# Altium project dvrk-s-pwm.PrjPCB (part 1 of 2)
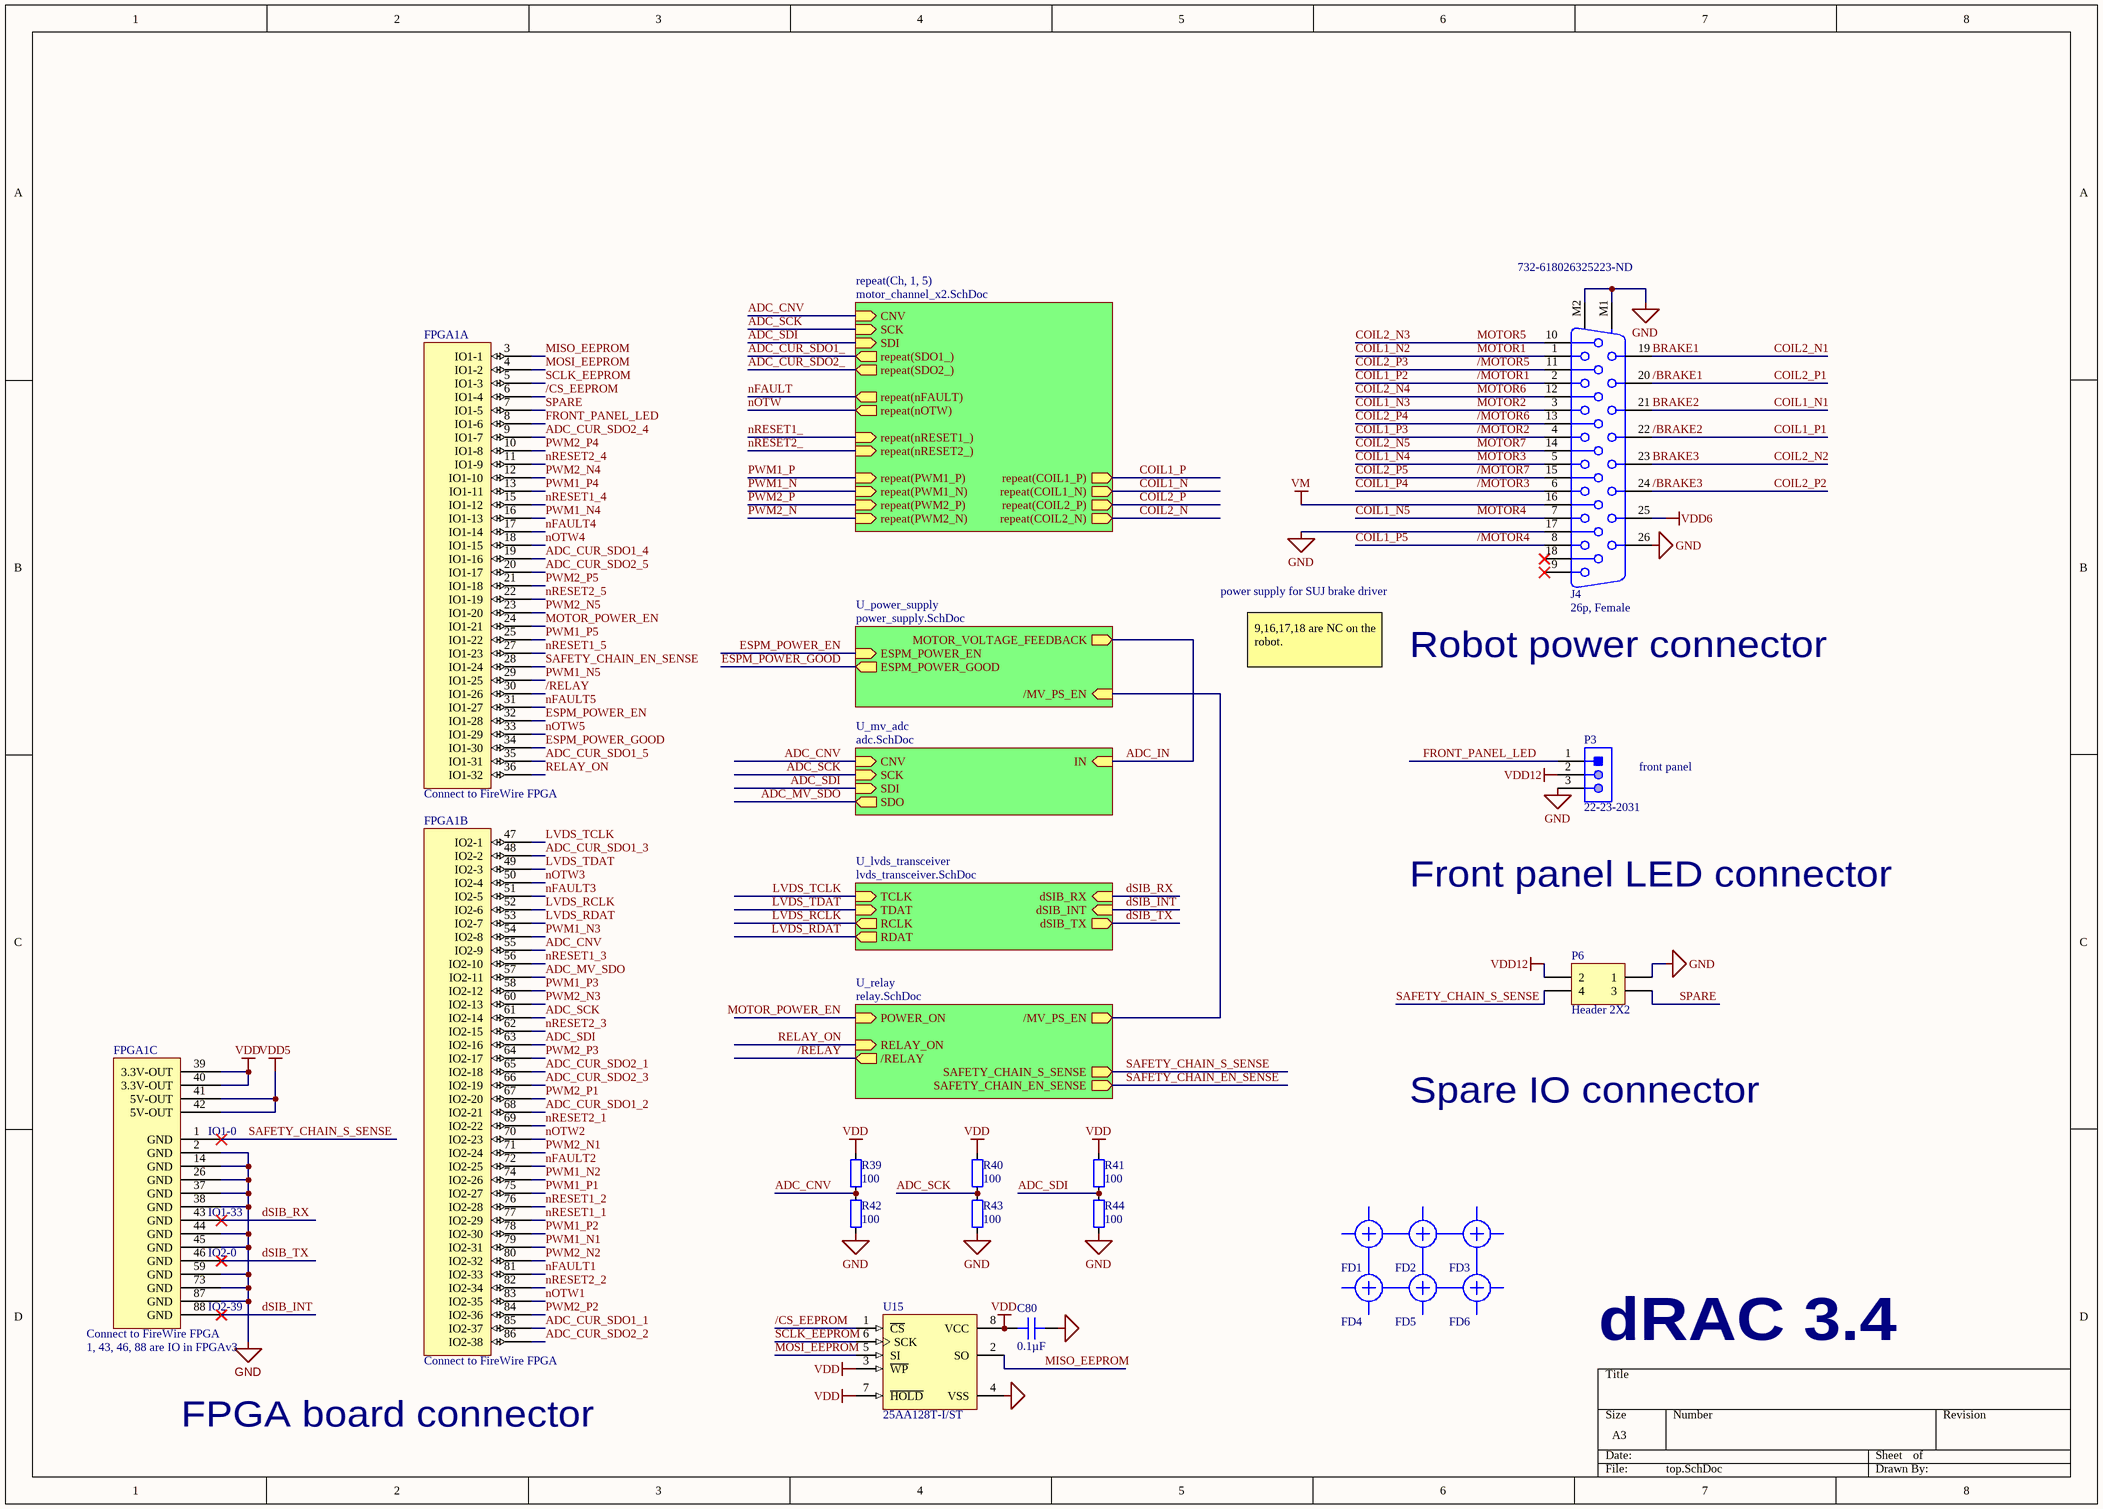
[diagram p0: top.SchDoc]
6 sheets, 492 parts. Net scope: hierarchical (ports join the sheet entries above them; power ports are global).
Board files: drac_v3.PcbDoc, drac_v3_panel.PcbDoc
Sheets:
  top.SchDoc
    U_mv_adc = adc.SchDoc
    U_power_supply = power_supply.SchDoc
    U_lvds_transceiver = lvds_transceiver.SchDoc
    U_relay = relay.SchDoc
    Ch1 = motor_channel_x2.SchDoc
    Ch2 = motor_channel_x2.SchDoc
    Ch3 = motor_channel_x2.SchDoc
    Ch4 = motor_channel_x2.SchDoc
    Ch5 = motor_channel_x2.SchDoc

## Sheet top.SchDoc
size A3; DocumentNumber: 1; SheetNumber: 1; SheetTotal: 6

### Parts
C80  0.1µF  [FP-GRM155-0_05-IPC_B]
FD1  FD  [FD]  (value not drawn)  (no BOM)
FD2  FD  [FD]  (value not drawn)  (no BOM)
FD3  FD  [FD]  (value not drawn)  (no BOM)
FD4  FD  [FD]  (value not drawn)  (no BOM)
FD5  FD  [FD]  (value not drawn)  (no BOM)
FD6  FD  [FD]  (value not drawn)  (no BOM)
FPGA1  Connect to FireWire FPGA  [FPGA-dummy]  (parts A,B,C of 3)
J4  26p, Female  Supplier Part Number 1: 732-618026325223-ND  [618026325223]
P3  22-23-2031  [MOLX-22-23-2031_V]
P6  Header 2X2  [DF11-4DP-2DSA]
R39  value 100  [FP-CRCW0805-HPe3-IPC_B]  (hidden comment: Res_0805)
R40  value 100  [FP-CRCW0805-HPe3-IPC_B]  (hidden comment: Res_0805)
R41  value 100  [FP-CRCW0805-HPe3-IPC_B]  (hidden comment: Res_0805)
R42  value 100  [FP-CRCW0805-HPe3-IPC_B]  (hidden comment: Res_0805)
R43  value 100  [FP-CRCW0805-HPe3-IPC_B]  (hidden comment: Res_0805)
R44  value 100  [FP-CRCW0805-HPe3-IPC_B]  (hidden comment: Res_0805)
U15  25AA128T-I/ST  [TSSOP-ST8_N]

### Sub-sheets
repeat(Ch, 1, 5) = motor_channel_x2.SchDoc: repeat(COIL1_P) (out), repeat(COIL1_N) (out), repeat(COIL2_P) (out), repeat(COIL2_N) (out), repeat(SDO1_) (out), repeat(SDO2_) (out), CNV (in), SCK (in), SDI (in), repeat(nRESET1_) (in), repeat(nRESET2_) (in), repeat(PWM1_P) (in), repeat(PWM1_N) (in), repeat(PWM2_P) (in), repeat(PWM2_N) (in), repeat(nFAULT) (out), repeat(nOTW) (out)
U_lvds_transceiver = lvds_transceiver.SchDoc: RCLK (out), RDAT (out), TCLK (in), TDAT (in), dSIB_RX (in), dSIB_INT (in), dSIB_TX (out)
U_mv_adc = adc.SchDoc: CNV (in), SCK (in), SDI (in), SDO (out), IN (in)
U_power_supply = power_supply.SchDoc: MOTOR_VOLTAGE_FEEDBACK (out), ESPM_POWER_GOOD (out), ESPM_POWER_EN (in), /MV_PS_EN (in)
U_relay = relay.SchDoc: POWER_ON (in), RELAY_ON (in), /RELAY (out), /MV_PS_EN (out), SAFETY_CHAIN_S_SENSE (out), SAFETY_CHAIN_EN_SENSE (out)

### Nets
GND: C80.2 FPGA1.2(GND) FPGA1.14(GND) FPGA1.26(GND) FPGA1.37(GND) FPGA1.38(GND) FPGA1.44(GND) FPGA1.45(GND) FPGA1.59(GND) FPGA1.73(GND) FPGA1.87(GND) J4.17 J4.26 J4.M1 J4.M2 P3.3 P6.1 R42.1 R43.1 R44.1 U15.4(VSS)
VDD: C80.1 FPGA1.39(3.3V-OUT) FPGA1.40(3.3V-OUT) R39.2 R40.2 R41.2 U15.3(~{WP}) U15.7(~{HOLD}) U15.8(VCC)
VDD5: FPGA1.41(5V-OUT) FPGA1.42(5V-OUT)
VDD6: J4.25
VDD12: P3.2 P6.2
VM: J4.16
/BRAKE1: J4.20  [also labelled COIL2_P1]
/BRAKE2: J4.22  [also labelled COIL1_P1]
/BRAKE3: J4.24  [also labelled COIL2_P2]
/CS_EEPROM: FPGA1.6(IO1-4) U15.1(~{CS})
/MOTOR1: J4.2  [also labelled COIL1_P2]
/MOTOR2: J4.4  [also labelled COIL1_P3]
/MOTOR3: J4.6  [also labelled COIL1_P4]
/MOTOR4: J4.8  [also labelled COIL1_P5]
/MOTOR5: J4.11  [also labelled COIL2_P3]
/MOTOR6: J4.13  [also labelled COIL2_P4]
/MOTOR7: J4.15  [also labelled COIL2_P5]
/RELAY: FPGA1.30(IO1-26) ; sheet U_relay//RELAY
ADC_CNV: FPGA1.55(IO2-9) R39.1 R42.2 ; sheet U_mv_adc/CNV, sheet repeat(Ch, 1, 5)/CNV
ADC_CUR_SDO1_: sheet repeat(Ch, 1, 5)/repeat(SDO1_)
ADC_CUR_SDO1_1: FPGA1.85(IO2-37)
ADC_CUR_SDO1_2: FPGA1.68(IO2-21)
ADC_CUR_SDO1_3: FPGA1.48(IO2-2)
ADC_CUR_SDO1_4: FPGA1.19(IO1-16)
ADC_CUR_SDO1_5: FPGA1.35(IO1-31)
ADC_CUR_SDO2_: sheet repeat(Ch, 1, 5)/repeat(SDO2_)
ADC_CUR_SDO2_1: FPGA1.65(IO2-18)
ADC_CUR_SDO2_2: FPGA1.86(IO2-38)
ADC_CUR_SDO2_3: FPGA1.66(IO2-19)
ADC_CUR_SDO2_4: FPGA1.9(IO1-7)
ADC_CUR_SDO2_5: FPGA1.20(IO1-17)
ADC_IN: sheet U_mv_adc/IN, sheet U_power_supply/MOTOR_VOLTAGE_FEEDBACK
ADC_MV_SDO: FPGA1.57(IO2-11) ; sheet U_mv_adc/SDO
ADC_SCK: FPGA1.61(IO2-14) R40.1 R43.2 ; sheet U_mv_adc/SCK, sheet repeat(Ch, 1, 5)/SCK
ADC_SDI: FPGA1.63(IO2-16) R41.1 R44.2 ; sheet U_mv_adc/SDI, sheet repeat(Ch, 1, 5)/SDI
BRAKE1: J4.19  [also labelled COIL2_N1]
BRAKE2: J4.21  [also labelled COIL1_N1]
BRAKE3: J4.23  [also labelled COIL2_N2]
COIL1_N: sheet repeat(Ch, 1, 5)/repeat(COIL1_N)
COIL1_N2: J4.1  [also labelled MOTOR1]
COIL1_N3: J4.3  [also labelled MOTOR2]
COIL1_N4: J4.5  [also labelled MOTOR3]
COIL1_N5: J4.7  [also labelled MOTOR4]
COIL1_P: sheet repeat(Ch, 1, 5)/repeat(COIL1_P)
COIL2_N: sheet repeat(Ch, 1, 5)/repeat(COIL2_N)
COIL2_N3: J4.10  [also labelled MOTOR5]
COIL2_N4: J4.12  [also labelled MOTOR6]
COIL2_N5: J4.14  [also labelled MOTOR7]
COIL2_P: sheet repeat(Ch, 1, 5)/repeat(COIL2_P)
dSIB_INT: FPGA1.88(GND) ; sheet U_lvds_transceiver/dSIB_INT
dSIB_RX: FPGA1.43(GND) ; sheet U_lvds_transceiver/dSIB_RX
dSIB_TX: FPGA1.46(GND) ; sheet U_lvds_transceiver/dSIB_TX
ESPM_POWER_EN: FPGA1.32(IO1-28) ; sheet U_power_supply/ESPM_POWER_EN
ESPM_POWER_GOOD: FPGA1.34(IO1-30) ; sheet U_power_supply/ESPM_POWER_GOOD
FRONT_PANEL_LED: FPGA1.8(IO1-6) P3.1
LVDS_RCLK: FPGA1.52(IO2-6) ; sheet U_lvds_transceiver/RCLK
LVDS_RDAT: FPGA1.53(IO2-7) ; sheet U_lvds_transceiver/RDAT
LVDS_TCLK: FPGA1.47(IO2-1) ; sheet U_lvds_transceiver/TCLK
LVDS_TDAT: FPGA1.49(IO2-3) ; sheet U_lvds_transceiver/TDAT
MISO_EEPROM: FPGA1.3(IO1-1) U15.2(SO)
MOSI_EEPROM: FPGA1.4(IO1-2) U15.5(SI)
MOTOR_POWER_EN: FPGA1.24(IO1-21) ; sheet U_relay/POWER_ON
nFAULT: sheet repeat(Ch, 1, 5)/repeat(nFAULT)
nFAULT1: FPGA1.81(IO2-33)
nFAULT2: FPGA1.72(IO2-25)
nFAULT3: FPGA1.51(IO2-5)
nFAULT4: FPGA1.17(IO1-14)
nFAULT5: FPGA1.31(IO1-27)
nOTW: sheet repeat(Ch, 1, 5)/repeat(nOTW)
nOTW1: FPGA1.83(IO2-35)
nOTW2: FPGA1.70(IO2-23)
nOTW3: FPGA1.50(IO2-4)
nOTW4: FPGA1.18(IO1-15)
nOTW5: FPGA1.33(IO1-29)
nRESET1_: sheet repeat(Ch, 1, 5)/repeat(nRESET1_)
nRESET1_1: FPGA1.77(IO2-29)
nRESET1_2: FPGA1.76(IO2-28)
nRESET1_3: FPGA1.56(IO2-10)
nRESET1_4: FPGA1.15(IO1-12)
nRESET1_5: FPGA1.27(IO1-23)
nRESET2_: sheet repeat(Ch, 1, 5)/repeat(nRESET2_)
nRESET2_1: FPGA1.69(IO2-22)
nRESET2_2: FPGA1.82(IO2-34)
nRESET2_3: FPGA1.62(IO2-15)
nRESET2_4: FPGA1.11(IO1-9)
nRESET2_5: FPGA1.22(IO1-19)
PWM1_N: sheet repeat(Ch, 1, 5)/repeat(PWM1_N)
PWM1_N1: FPGA1.79(IO2-31)
PWM1_N2: FPGA1.74(IO2-26)
PWM1_N3: FPGA1.54(IO2-8)
PWM1_N4: FPGA1.16(IO1-13)
PWM1_N5: FPGA1.29(IO1-25)
PWM1_P: sheet repeat(Ch, 1, 5)/repeat(PWM1_P)
PWM1_P1: FPGA1.75(IO2-27)
PWM1_P2: FPGA1.78(IO2-30)
PWM1_P3: FPGA1.58(IO2-12)
PWM1_P4: FPGA1.13(IO1-11)
PWM1_P5: FPGA1.25(IO1-22)
PWM2_N: sheet repeat(Ch, 1, 5)/repeat(PWM2_N)
PWM2_N1: FPGA1.71(IO2-24)
PWM2_N2: FPGA1.80(IO2-32)
PWM2_N3: FPGA1.60(IO2-13)
PWM2_N4: FPGA1.12(IO1-10)
PWM2_N5: FPGA1.23(IO1-20)
PWM2_P: sheet repeat(Ch, 1, 5)/repeat(PWM2_P)
PWM2_P1: FPGA1.67(IO2-20)
PWM2_P2: FPGA1.84(IO2-36)
PWM2_P3: FPGA1.64(IO2-17)
PWM2_P4: FPGA1.10(IO1-8)
PWM2_P5: FPGA1.21(IO1-18)
RELAY_ON: FPGA1.36(IO1-32) ; sheet U_relay/RELAY_ON  [project net RELAY-ON]
SAFETY_CHAIN_EN_SENSE: FPGA1.28(IO1-24) ; sheet U_relay/SAFETY_CHAIN_EN_SENSE
SAFETY_CHAIN_S_SENSE: FPGA1.1(GND) P6.4 ; sheet U_relay/SAFETY_CHAIN_S_SENSE
SCLK_EEPROM: FPGA1.5(IO1-3) U15.6(SCK)
SPARE: FPGA1.7(IO1-5) P6.3
NetJ2_1: sheet U_power_supply//MV_PS_EN, sheet U_relay//MV_PS_EN

Not connected (* = marked no-connect by the designer): J4 9* 18*

### Notes on the sheet
- power supply for SUJ brake driver
- 9,16,17,18 are NC on the robot.
- Robot power connector
- front panel
- Front panel LED connector
- Spare IO connector
- (near FPGA1) IO1-0
- (near FPGA1) IO1-33
- (near FPGA1) IO2-0
- (near FPGA1) IO2-39
- (near FPGA1) 1, 43, 46, 88 are IO in FPGAv3
- dRAC 3.4
- FPGA board connector

### Library data of the parts
C80 = 04023C104KAT2A: CAP CER 0.1UF 25V X7R 0402; Manufacturer: AVX Corporation; Tolerance: ±10%; Value: 0.1µF; Part Number: 04023C104KAT2A; Applications: General Purpose; Capacitance: 0.1µF; ComponentLink1Description: Datasheet; ComponentLink1URL: http://datasheets.avx.com/X7RDielectric.pdf; ComponentLink2Description: DigiKey Link; ComponentLink2URL: http://digikey.com/product-detail/en/avx-corporation/04023C104KAT2A/478-7868-1-ND/3881491; Device Package: 0402 (1005 Metric); LastUpdated: 9/2/2020 1:02:21 AM; Lifecycle Status: Active; Minimum Order: 1; Mounting Type: Surface Mount, MLCC; Operating Temperature: -55°C ~ 125°C; Package / Case: 0402 (1005 Metric); Packaging: CutTape; PartId: 3190; Part Status: Active; Price: 0.13; Series: -; Size / Dimension: 0.039" L x 0.020" W (1.00mm x 0.50mm); Supplier 1: DigiKey; Supplier Part Number 1: 478-7868-1-ND; Temperature Coefficient: X7R; Thickness (Max): 0.022" (0.55mm); Voltage - Rated: 25V
FPGA1 = fpga_dummy: ClassName: noclearancecheck
J4 = 618026325223: WR-DSUB Female High Density Angled PCB Connector without Hex Screw, 26p; Manufacturer: Wurth Electronics; PinNumber: 26; Published: June 2016; Publisher: Wurth Elektronik; ComponentLink1Description: Manufacturer; ComponentLink1URL: http://www.we-online.de; ComponentLink2Description: Datasheet; ComponentLink2URL: http://katalog.we-online.de/em/datasheet/6180xx325223.pdf; PartNumber: 618026325223; system: connector; Supplier 1: Digi-Key; Manufacturer Part Number: 618026325223; RoHS: Yes; Stock 1: 325; Pricing 1: 1=8.10000, 10=7.69500, 50=7.15500, 100=6.75000, 250=6.21000, 500=5.40002 (USD); RoHS Compliant: Yes
P3 = CMP-2000-05242-1: Male Header, Pitch 2.54 mm, 1 x 3 Position, Height 8.18 mm, Tail Length 3.56 mm, RoHS, Bulk; Current Rating: 4A; Brand: Molex; Pitch: 2.54mm; Voltage Rating: 250V; Mounting Angle: Vertical; Type: Locking; Factory Pack Quantity: 16000; Tradename: KK; Housing Material: Nylon; Contact Material: Brass; Manufacturer URL: http://www.molex.com/; Termination Style: ThroughHole; Mounting Style: ThroughHole; Number of Positions: 3Position; Contact Gender: Pin(Male); Packaging: Bulk; Series: 6373; Datasheet Version: Sep-01; Contact Plating: Tin; Product: Headers; Datasheet URL: https://datasheet.ciiva.com/19472/232274-19472863.pdf; RoHS: Details; Product Category: Headers&WireHousings; Manufacturer: Molex; Number of Rows: 1Row
P6 = Header 2X2: Header, 2-Pin, Dual row; LatestRevisionDate: 17-Jul-2002; LatestRevisionNote: Re-released for DXP Platform.; Publisher: Altium Limited
R39-R44 = Res_0805: Resistor
U15 = CMP-0165-00422-1: 128K SPI Bus Serial EEPROM, 8-Pin TSSOP, Industrial Temperature, Tape and Reel; PackageVersion: revBB, Aug-2009; PackageDescription: 8-Lead Plastic Thin Shrink Small Outline (ST) - 4.4mm Body [TSSOP]; Code_JEDEC: MO-153; DatasheetVersion: revD, Jun-2009; PackageReference: TSSOP-ST8

## Sheet adc.SchDoc
size Letter; DocumentNumber: 6; SheetNumber: 6; SheetTotal: 6
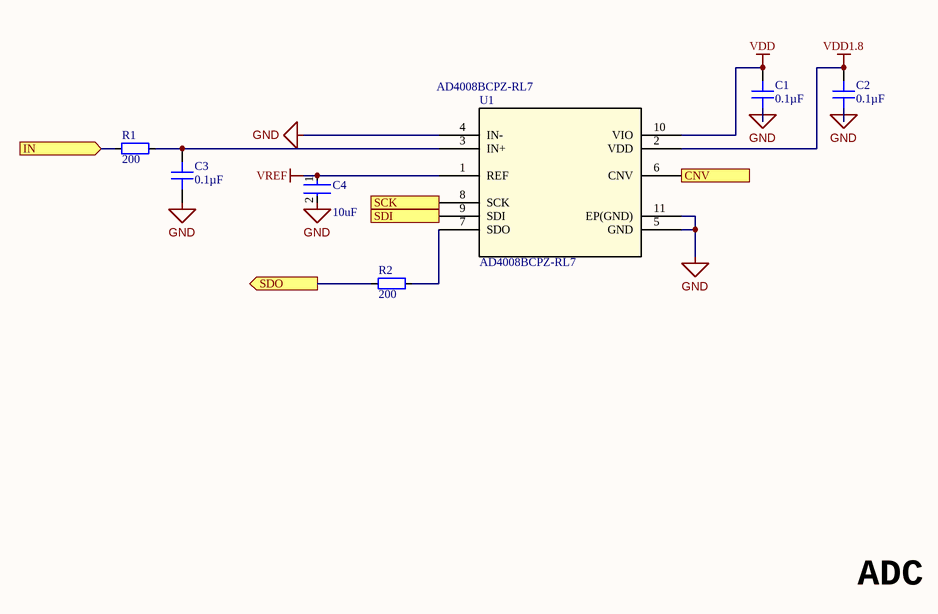
[diagram p1: adc.SchDoc]

### Parts
C1  0.1µF  [FP-GRM155-0_05-IPC_B]
C2  0.1µF  [FP-GRM155-0_05-IPC_B]
C3  0.1µF  [FP-GRM155-0_05-IPC_B]
C4  Capacitance: 10uF  [FP-CL21-IPC_C]  (hidden comment: CL21B106KQQNNNG)
R1  value 200  [FP-CRCW0402-e3-IPC_B]  (hidden comment: Res_0402)
R2  value 200  [FP-CRCW0402-e3-IPC_B]  (hidden comment: Res_0402)
U1  AD4008BCPZ-RL7  [CP_10_9]

### Ports
CNV (in), IN (in), SCK (in), SDI (in), SDO (out)

### Nets
GND: C1.2 C2.2 C3.2 C4.2 U1.4(IN-) U1.5(GND) U1.11(EP(GND))
VDD: C1.1 U1.10(VIO)
VDD1.8: C2.1 U1.2(VDD)
VREF: C4.1 U1.1(REF)
ADC_CNV: U1.6(CNV) ; port CNV
ADC_IN: R1.1 ; port IN
ADC_MV_SDO: R2.1 ; port SDO
ADC_SCK: U1.8(SCK) ; port SCK
ADC_SDI: U1.9(SDI) ; port SDI
NetC3_1: C3.1 R1.2 U1.3(IN+)
NetR2_2: R2.2 U1.7(SDO)

### Notes on the sheet
- ADC

### Library data of the parts
C1-C3 = 04023C104KAT2A: as C80 on sheet top; Value: 0.1µF; ComponentLink1Description: Datasheet; ComponentLink1URL: http://datasheets.avx.com/X7RDielectric.pdf; Supplier 1: DigiKey; Supplier Part Number 1: 478-7868-1-ND; Part Number: 04023C104KAT2A; Applications: General Purpose; Capacitance: 0.1µF; ComponentLink2Description: DigiKey Link; ComponentLink2URL: http://digikey.com/product-detail/en/avx-corporation/04023C104KAT2A/478-7868-1-ND/3881491; Device Package: 0402 (1005 Metric); LastUpdated: 9/2/2020 1:02:21 AM; Lifecycle Status: Active; Minimum Order: 1; Mounting Type: Surface Mount, MLCC; Operating Temperature: -55°C ~ 125°C; Package / Case: 0402 (1005 Metric); Packaging: CutTape; PartId: 3190; Part Status: Active; Price: 0.13; Series: -; Size / Dimension: 0.039" L x 0.020" W (1.00mm x 0.50mm); Temperature Coefficient: X7R; Thickness (Max): 0.022" (0.55mm); Voltage - Rated: 25V
C4 = CMP-13271-001427-1: CL21 Series 0805 10uF 6.3V ±10% Tolerance X7R Multilayer Ceramic Chip Capacitor; Min Operating Temperature: -55°C; Dielectric: X7R; Voltage Rating: 6.3V; Case/Package: 0805; Height: 1.25mm; Case Code (Metric): 2012; Tolerance: 10%; Packaging: Tape and Reel; Thickness: 0.055inch; Voltage: 6.3V; Max Operating Temperature: 125°C; Lead Free: Lead Free; Package Quantity: 3000; Case Code (Imperial): 0805; Depth: 1.25mm; Width: 0.049inch; Length: 2mm; Mount: Surface Mount
R1 R2 = Res_0402: Resistor
U1 = AD4008BCPZ-RL7: 16-Bit, 2 MSPS/1 MSPS/500 kSPS, / Precision, Pseudo Differential, SAR ADCs; Value: Value; Type: Type; RefDes: RefDes; Supplier 1: Arrow Electronics; Supplier Part Number 1: AD4008BCPZ-RL7

## Sheet power_supply.SchDoc
size Letter; DocumentNumber: 3; SheetNumber: 3; SheetTotal: 6
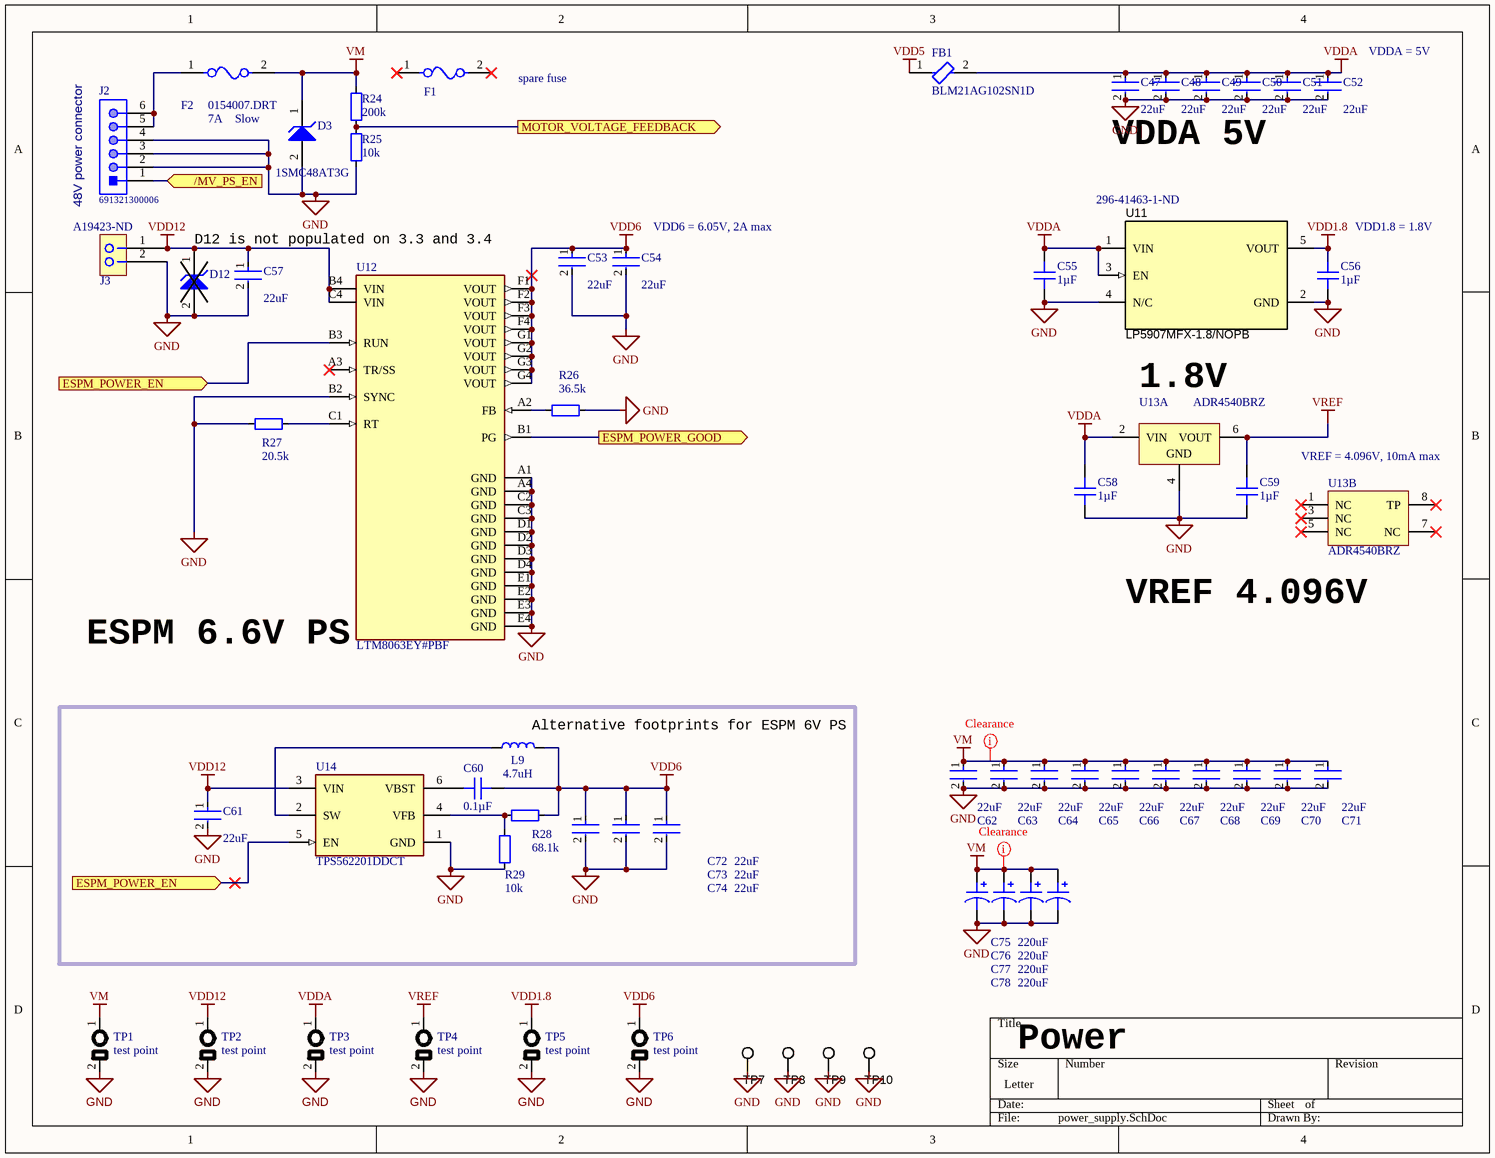
[diagram p2: power_supply.SchDoc]

### Parts
C47  Capacitance: 22uF  [FP-CL32-IPC_B]  (hidden comment: CL32B226MOJNNNE)
C48  Capacitance: 22uF  [FP-CL32-IPC_B]  (hidden comment: CL32B226MOJNNNE)
C49  Capacitance: 22uF  [FP-CL32-IPC_B]  (hidden comment: CL32B226MOJNNNE)
C50  Capacitance: 22uF  [FP-CL32-IPC_B]  (hidden comment: CL32B226MOJNNNE)
C51  Capacitance: 22uF  [FP-CL32-IPC_B]  (hidden comment: CL32B226MOJNNNE)
C52  Capacitance: 22uF  [FP-CL32-IPC_B]  (hidden comment: CL32B226MOJNNNE)
C53  Capacitance: 22uF  [FP-CL32-IPC_B]  (hidden comment: CL32B226MOJNNNE)
C54  Capacitance: 22uF  [FP-CL32-IPC_B]  (hidden comment: CL32B226MOJNNNE)
C55  1µF  [FP-GRM155-0_05-IPC_B]
C56  1µF  [FP-GRM155-0_05-IPC_B]
C57  Capacitance: 22uF  [FP-CL32-IPC_B]  (hidden comment: CL32B226MOJNNNE)
C58  1µF  [FP-GRM155-0_05-IPC_B]
C59  1µF  [FP-GRM155-0_05-IPC_B]
C60  0.1µF  [FP-GRM155-0_05-IPC_B]
C61  Capacitance: 22uF  [FP-CL32-IPC_B]  (hidden comment: CL32B226MOJNNNE)
C62  Capacitance: 22uF  [FP-KRM55W-6_1_5_3_6_7_1_2-MFG]  (hidden comment: KRM55WR72A226MH01L)
C63  Capacitance: 22uF  [FP-KRM55W-6_1_5_3_6_7_1_2-MFG]  (hidden comment: KRM55WR72A226MH01L)
C64  Capacitance: 22uF  [FP-KRM55W-6_1_5_3_6_7_1_2-MFG]  (hidden comment: KRM55WR72A226MH01L)
C65  Capacitance: 22uF  [FP-KRM55W-6_1_5_3_6_7_1_2-MFG]  (hidden comment: KRM55WR72A226MH01L)
C66  Capacitance: 22uF  [FP-KRM55W-6_1_5_3_6_7_1_2-MFG]  (hidden comment: KRM55WR72A226MH01L)
C67  Capacitance: 22uF  [FP-KRM55W-6_1_5_3_6_7_1_2-MFG]  (hidden comment: KRM55WR72A226MH01L)
C68  Capacitance: 22uF  [FP-KRM55W-6_1_5_3_6_7_1_2-MFG]  (hidden comment: KRM55WR72A226MH01L)
C69  Capacitance: 22uF  [FP-KRM55W-6_1_5_3_6_7_1_2-MFG]  (hidden comment: KRM55WR72A226MH01L)
C70  Capacitance: 22uF  [FP-KRM55W-6_1_5_3_6_7_1_2-MFG]  (hidden comment: KRM55WR72A226MH01L)
C71  Capacitance: 22uF  [FP-KRM55W-6_1_5_3_6_7_1_2-MFG]  (hidden comment: KRM55WR72A226MH01L)
C72  Capacitance: 22uF  [FP-CL32-IPC_B]  (hidden comment: CL32B226MOJNNNE)
C73  Capacitance: 22uF  [FP-CL32-IPC_B]  (hidden comment: CL32B226MOJNNNE)
C74  Capacitance: 22uF  [FP-CL32-IPC_B]  (hidden comment: CL32B226MOJNNNE)
C75  Capacitance: 220uF  [100TXW220MEFC10X40_horizontal]
C76  Capacitance: 220uF  [100TXW220MEFC10X40_horizontal]
C77  Capacitance: 220uF  [100TXW220MEFC10X40_horizontal]
C78  Capacitance: 220uF  [100TXW220MEFC10X40_horizontal]
D3  1SMC48AT3G  [ONSC-SMC-2-403-03_V]
D12  1SMA12AT3G  [ONSC-SMA-2-403D-02_F_V]  (value not drawn)
F1  0154007.DRT  [FP-0154-MFG]  (value not drawn)
F2  0154007.DRT  Fuse Current: 7A  Fuse Blow Speed: Slow  [FP-0154-MFG]
FB1  BLM21AG102SN1D  [FP-BLM21-0_2-t0_85-e0_5-MFG]
J2  691321300006  [691321300006]
J3  Supplier Part Number 1: A19423-ND  [HDR-2x1-100]  (hidden comment: Substitute with tyco 640457-2)
L9  4.7uH  [INDUCTOR-XAL7030]
R24  value 200k  [FP-CRCW0402-e3-IPC_B]  (hidden comment: Res_0402)
R25  value 10k  [FP-CRCW0402-e3-IPC_B]  (hidden comment: Res_0402)
R26  value 36.5k  [FP-CRCW0402-e3-IPC_B]  (hidden comment: Res_0402)
R27  value 20.5k  [FP-CRCW0402-e3-IPC_B]  (hidden comment: Res_0402)
R28  value 68.1k  [FP-CRCW0402-e3-IPC_B]  (hidden comment: Res_0402)
R29  value 10k  [FP-CRCW0402-e3-IPC_B]  (hidden comment: Res_0402)
TP1  test point  [TP_GND]  (no BOM)
TP2  test point  [TP_GND]  (no BOM)
TP3  test point  [TP_GND]  (no BOM)
TP4  test point  [TP_GND]  (no BOM)
TP5  test point  [TP_GND]  (no BOM)
TP6  test point  [TP_GND]  (no BOM)
TP7  5016  [Testpoint_Keystone_Compact]  (value not drawn)
TP8  5016  [Testpoint_Keystone_Compact]  (value not drawn)
TP9  5016  [Testpoint_Keystone_Compact]  (value not drawn)
TP10  5016  [Testpoint_Keystone_Compact]  (value not drawn)
U11  LP5907MFX-1.8/NOPB  Supplier Part Number 1: 296-41463-1-ND  [DBV0005A_N]
U12  LTM8063EY#PBF  [FP-BGA-28-05-08-1517-MFG]
U13  ADR4540BRZ  [ADI-R-8_M]  (parts A,B of 2)
U14  TPS562201DDCT  [FP-DDC0006A-IPC_C]

### Blocks framed on the sheet
Alternative footprints for ESPM 6V PS: C60 C61 C72-C74 L9 R28 R29 U14

### Ports
/MV_PS_EN (in), ESPM_POWER_EN (in), ESPM_POWER_GOOD (out), MOTOR_VOLTAGE_FEEDBACK (out)

### Nets
GND: C47.2 C48.2 C49.2 C50.2 C51.2 C52.2 C53.2 C54.2 C55.1 C56.1 C57.2 C58.1 C59.1 C61.2 C62.2 C63.2 C64.2 C65.2 C66.2 C67.2 C68.2 C69.2 C70.2 C71.2 C72.2 C73.2 C74.2 C75.2 C76.2 C77.2 C78.2 D3.2(A) D12.2(A) J2.2 J2.3 J2.4 J3.2 R25.1 R26.1 R27.2 R29.1 TP1.2(gnd) TP2.2(gnd) TP3.2(gnd) TP4.2(gnd) TP5.2(gnd) TP6.2(gnd) TP7.1 TP8.1 TP9.1 TP10.1 U11.2(GND) U11.4(N/C) U12.A1(GND) U12.A4(GND) U12.B2(SYNC) U12.C2(GND) U12.C3(GND) U12.D1(GND) U12.D2(GND) U12.D3(GND) U12.D4(GND) U12.E1(GND) U12.E2(GND) U12.E3(GND) U12.E4(GND) U13.4(GND) U14.1(GND)
VDD1.8: C56.2 TP5.1 U11.5(VOUT)
VDD5: FB1.1
VDD6: C53.1 C54.1 C60.2 C72.1 C73.1 C74.1 L9.2 R28.1 TP6.1 U12.F1(VOUT) U12.F2(VOUT) U12.F3(VOUT) U12.F4(VOUT) U12.G1(VOUT) U12.G2(VOUT) U12.G3(VOUT) U12.G4(VOUT)
VDD12: C57.1 C61.1 D12.1(K) J3.1 TP2.1 U12.B4(VIN) U12.C4(VIN) U14.3(VIN)
VDDA: C47.1 C48.1 C49.1 C50.1 C51.1 C52.1 C55.2 C58.2 FB1.2 TP3.1 U11.1(VIN) U11.3(EN) U13.2(VIN)
VM: C62.1 C63.1 C64.1 C65.1 C66.1 C67.1 C68.1 C69.1 C70.1 C71.1 C75.1 C76.1 C77.1 C78.1 D3.1(K) F2.2 R24.2 TP1.1
VREF: C59.2 TP4.1 U13.6(VOUT)
ADC_IN: R24.1 R25.2 ; port MOTOR_VOLTAGE_FEEDBACK
ESPM_POWER_EN: U12.B3(RUN) U14.5(EN) ; port ESPM_POWER_EN
ESPM_POWER_GOOD: U12.B1(PG) ; port ESPM_POWER_GOOD
NetC60_1: C60.1 U14.6(VBST)
NetF2_1: F2.1 J2.5 J2.6
NetJ2_1: J2.1 ; port /MV_PS_EN
NetL9_1: L9.1 U14.2(SW)
NetR26_2: R26.2 U12.A2(FB)
NetR27_1: R27.1 U12.C1(RT)
NetR28_2: R28.2 R29.2 U14.4(VFB)

Not connected (* = marked no-connect by the designer): F1 1* 2*; U12 A3(TR/SS)*; U13 1(NC)* 3(NC)* 5(NC)* 7(NC)* 8(TP)*

### Layout directives
net class hv: VM

### Notes on the sheet
- spare fuse
- (near C52) VDDA = 5V
- VDDA 5V
- 48V power connector
- (near C54) VDD6 = 6.05V, 2A max
- (near C56) VDD1.8 = 1.8V
- D12 is not populated on 3.3 and 3.4
- 1.8V
- VREF = 4.096V, 10mA max
- (near U13) VREF 4.096V
- (near U12) ESPM 6.6V PS
- Power

### Library data of the parts
C47-C54 C57 C61 C72-C74 = CMP-13271-003818-1: Cap Ceramic 22uF 16V X7R ±20% SMD 1210 +125°C Embossed T/R; Mount: Surface Mount; Case/Package: 1210; Case Code (Imperial): 1210; Depth: 2.5mm; Packaging: Tape and Reel; Case Code (Metric): 3225; Package Quantity: 1; Min Operating Temperature: -55°C; Dielectric: X7R; Height: 2.5mm; Length: 3.2mm; Max Operating Temperature: 125°C; Thickness: 0.106inch; Width: 0.098inch; Tolerance: 20%; Voltage Rating: 16V; Radiation Hardening: No
C55 C56 C58 C59 = GRM155R70J105KA12J: CAP CER 1UF 6.3V X7R 0402; Manufacturer: Murata Electronics; Tolerance: ±10%; Value: 1µF; Part Number: GRM155R70J105KA12J; Applications: General Purpose; Capacitance: 1µF; ComponentLink1Description: Datasheet; ComponentLink1URL: https://search.murata.co.jp/Ceramy/image/img/A01X/G101/ENG/GRM155R70J105KA12-01.pdf; ComponentLink2Description: DigiKey Link; ComponentLink2URL: http://digikey.com/product-detail/en/murata-electronics/GRM155R70J105KA12J/490-13339-1-ND/5973350; Device Package: 0402 (1005 Metric); LastUpdated: 9/2/2020 1:02:22 AM; Lifecycle Status: Active; Minimum Order: 1; Mounting Type: Surface Mount, MLCC; Operating Temperature: -55°C ~ 125°C; Package / Case: 0402 (1005 Metric); Packaging: TapeAndReel; PartId: 2890; Part Status: Active; Price: 0.01; Series: GRM; Size / Dimension: 0.039" L x 0.020" W (1.00mm x 0.50mm); Supplier 1: DigiKey; Supplier Part Number 1: 490-13339-1-ND; Temperature Coefficient: X7R; Thickness (Max): 0.022" (0.55mm); Voltage - Rated: 6.3V
C60 = 04023C104KAT2A: as C80 on sheet top; Value: 0.1µF; ComponentLink1Description: Datasheet; ComponentLink1URL: http://datasheets.avx.com/X7RDielectric.pdf; Supplier 1: DigiKey; Supplier Part Number 1: 478-7868-1-ND; Part Number: 04023C104KAT2A; Applications: General Purpose; Capacitance: 0.1µF; ComponentLink2Description: DigiKey Link; ComponentLink2URL: http://digikey.com/product-detail/en/avx-corporation/04023C104KAT2A/478-7868-1-ND/3881491; Device Package: 0402 (1005 Metric); LastUpdated: 9/2/2020 1:02:21 AM; Lifecycle Status: Active; Minimum Order: 1; Mounting Type: Surface Mount, MLCC; Operating Temperature: -55°C ~ 125°C; Package / Case: 0402 (1005 Metric); Packaging: CutTape; PartId: 3190; Part Status: Active; Price: 0.13; Series: -; Size / Dimension: 0.039" L x 0.020" W (1.00mm x 0.50mm); Temperature Coefficient: X7R; Thickness (Max): 0.022" (0.55mm); Voltage - Rated: 25V
C62-C71 = CMP-06035-003571-1: CAP CER 22UF 100V X7R SMD; Tolerance: 20%; Lead/Base Style: J-Lead; Packaging: Cut Tape; Mount: Surface Mount; Min Operating Temperature: -55°C; Max Operating Temperature: 125°C; Case/Package: SMD/SMT; Voltage Rating: 100V; Supplier 1: Arrow Electronics; Supplier Part Number 1: KRM55WR72A226MH01L
C75-C78 = Polarised Capacitor: TXW Series 100 V 220 uF 10 x 40 mm LS=5 mm Radial Aluminum Electrolytic; Manufacturer: Rubycon; Manufacturer Part Number: 100TXW220MEFC10X40; Voltage Rating: 100V; Tolerance: 20%; Ripple Current: 1.3A; Life (Hours): 10000Hour; Supplier 1: Newark; Supplier Part Number 1: 08X4753; RoHS: Yes; Category: Aluminum Electrolytic Capacitors; Stock 1: 1030; Pricing 1: 1=2.39000, 10=1.89000, 25=1.76000, 50=1.64000, 100=1.41000, 500=1.07000 (USD); Mount: Through Hole; Case/Package: Radial; Min Operating Temperature: -25°C; Max Operating Temperature: 105°C; Package Quantity: 500; Packaging: Bulk; Voltage Rating (DC): 100V; Series: TXW; Diameter: 10mm; Height: 40mm; Lead Pitch: 0.197inch; Height - Seated (Max): 1.654inch; REACH SVHC: No SVHC; Lead Free: Lead Free; RoHS Compliant: Yes; ComponentLink1URL: https://datasheet.ciiva.com/6315/e-txw-6315783.pdf?src-supplier=Digi-Key; ComponentLink1Description: https://datasheet.ciiva.com/6315/e-txw-6315783.pdf?src-supplier=Digi-Key; ComponentLink2URL: https://datasheet.ciiva.com/22732/1910944-22732303.pdf?src-supplier=Element14; ComponentLink2Description: https://datasheet.ciiva.com/22732/1910944-22732303.pdf?src-supplier=Element14
D3 = CMP-1061-00550-1: 1500 W Peak Power Zener Transient Voltage Suppressor, Unidirectional, 2-Pin SMC, Pb-Free, Tape and Reel; Manufacturer: On Semiconductor; IR Max (uA): 5; PPK Max (W): 1500; V(BR) Typ (V): 56.1; RoHS: Pb-Free; Packing: Tape and Reel; ComponentLink1Description: Manufacturer URL; ComponentLink3URL: http://www.onsemi.com/pub_link/Collateral/403-03.PDF; PackageReference: SMC-2-403-03; PackageDescription: 2-Pin Small Molded Package, J-Bend Lead, Body 5.845 x 6.855 mm; ComponentLink2URL: http://www.onsemi.com/pub_link/Collateral/1SMC5.0AT3-D.PDF; PackageVersion: Rev. E, 08/2005; Mounting Technology: Surface Mount; DatasheetVersion: Rev. 8; PartNumber: 1SMC48AT3G; ComponentLink3Description: Package Specification; ComponentLink2Description: Datasheet; ComponentLink1URL: http://www.onsemi.com/; Direction: Unidirectional
D12 = CMP-1061-00233-1: 400 W Peak Power Zener Transient Voltage Suppressor, 2-Pin SMA, Pb-Free, Tape and Reel; Manufacturer: On Semiconductor; V(BR) Typ (V): 14; PPK Max (W): 400; IR Max (uA): 2.5; Direction: Unidirectional; PackageVersion: Rev. F, 11/2008; ComponentLink2URL: http://www.onsemi.com/pub_link/Collateral/1SMA5.0AT3-D.PDF; PackageReference: SMA-2-403D-02_F; ComponentLink3Description: Package Specification; PartNumber: 1SMA12AT3G; ComponentLink1URL: http://www.onsemi.com/; Packing: Tape and Reel; ComponentLink1Description: Manufacturer URL; PackageDescription: 2-Pin Small Molded Package, J-Bend Lead, Body 2.605 x 4.315 mm; RoHS: Pb-Free; ComponentLink2Description: Datasheet; DatasheetVersion: Rev. 14; ComponentLink3URL: http://www.onsemi.com/pub_link/Collateral/1SMA5913BT3-D.PDF; Mounting Technology: Surface Mount
F1 = CMP-08605-000019-1: FUSE BRD MNT 7A 72VAC 60VDC 2SMD; Manufacturer: Littelfuse Inc; Max Fuse Dc Voltage: 60V; Fuse Blow Speed: Slow; Max Fuse Ac Voltage: 72V; Manufacturer Part Number: 0154007.DRT; RoHS: TRUE; Temperature Range High: +125°C; Temperature: -55°C to +125°C; Digikey Description: FUSE BRD MNT 7A 72VAC 60VDC 2SMD; Device Class L3: unset; Package: 0154; Lead Free: Yes; Fuse Current: 7A; Temperature Range Low: -55°C; Automotive: No; Height: 3.81mm; Octopart: https://octopart.com/0154007.drt-littelfuse-19644006; Device Class L2: Fuses; Category: Fuse; ComponentLink2URL: https://www.littelfuse.com/~/media/electronics/datasheets/fuses/littelfuse_fuse_154_154t_154l_154tl_datasheet.pdf.pdf; ComponentLink2Description: Datasheet; Device Class L1: Circuit Protection; Mouser Description: Surface Mount Fuses ACS SMF OMNI-BLOK SB RoHS 7A
F2 = CMP-08605-000019-1: FUSE BRD MNT 7A 72VAC 60VDC 2SMD; Manufacturer: Littelfuse Inc; Max Fuse Dc Voltage: 60V; Max Fuse Ac Voltage: 72V; Manufacturer Part Number: 0154007.DRT; RoHS: TRUE; Temperature Range High: +125°C; Temperature: -55°C to +125°C; Digikey Description: FUSE BRD MNT 7A 72VAC 60VDC 2SMD; Device Class L3: unset; Package: 0154; Lead Free: Yes; Temperature Range Low: -55°C; Automotive: No; Height: 3.81mm; Octopart: https://octopart.com/0154007.drt-littelfuse-19644006; Device Class L2: Fuses; Category: Fuse; ComponentLink2URL: https://www.littelfuse.com/~/media/electronics/datasheets/fuses/littelfuse_fuse_154_154t_154l_154tl_datasheet.pdf.pdf; ComponentLink2Description: Datasheet; Device Class L1: Circuit Protection; Mouser Description: Surface Mount Fuses ACS SMF OMNI-BLOK SB RoHS 7A
FB1 = CMP-0686-00665-3: Chip Ferrite Bead, 0805, 1000Ω @ 100MHz, 0.27Ω, 25%, 600mA; Material: Steel; Number of Lines: 1; Current Rating: 500mA; Max DC Current: 200mA; Impedance: 1kR; DC Resistance (DCR): 280mR; Shielding: Unshielded; Length: 2mm; Max Current Rating: 600mA; Max Operating Temperature: 125°C; Lead Free: Lead Free; Test Frequency: 100MHz; Number of Pins: 2; Height: 0.85mm; Package Quantity: 1; Termination: SMD/SMT; Depth: 1.25mm; Radiation Hardening: No; Case Code (Metric): 2012; Tolerance: 25%; Core Material: Ferrite; Min Operating Temperature: -55°C; Case Code (Imperial): 0805; Weight: 0.000194oz; DC Current: 200mA; Case/Package: 0805; REACH SVHC: No SVHC; Frequency: 100MHz; Military Standard: Not; Number of Circuits: 1; Width: 1.25mm; Packaging: Tape and Reel
J2 = CMP-1502-01867-1: Serie 321 - 3.81mm Vertical PCB Header WR-TBL, 6 pin; Manufacturer: Wurth Elektronik; Gender: Male; Pin Number: 6; Pitch: 3.81mm; Manufacturer URL: http://www.we-online.de; Part Number: 691321300006; Datasheet URL: http://katalog.we-online.de/em/datasheet/6913213000xx.pdf; Mounting Technology: THT; Packaging: Box; Publisher: WurthElektronik; Operating Temperature: -40to105degC; Package Reference: 691321300006
J3 = HEADER 2: TE Connectivity MTA-100 Series, 2.54mm Pitch 2 Way 1 Row Straight PCB Header, Solder Termination, 5A; system: connector; Voltage Rating: 250V; Number of Contacts: 2; Plating Thickness: 3.81um; Shrouded: No (Without); Contact Resistance: 6mR; Gender: Male; Underplate Material: Nickel; Connector Type: Plug,Header,Pin; Connector System: Wire-to-Board; PCB Mount Retention: Without; PCB Mounting Orientation: Vertical; Contact Post Length: 3.56mm; PCB Thickness: 0.063inch; Approvals: CSA; Manufacturer: TE Connectivity; Manufacturer Part Number: 640457-2; Stock 1: 10901; Pricing 1: 1=0.14, 10=0.127, 100=0.0783, 500=0.06482, 1000=0.05672, 5000=0.04862, 10000=0.04727 (USD); Mount: Through Hole; Colour: White,Natural,Beige; Contact Plating: Tin; Min Operating Temperature: -67°C; Max Operating Temperature: 221°C; Packaging: Bulk; Fastening Type: Friction; Current Rating: 5A; Contact Gender: Male; Termination: Solder; Orientation: Right Angle; Contact Current Rating: 5A; Max Voltage Rating (AC): 250V; Contact Mating Length: 0.295inch; Termination Post Length: 3.56mm; Depth: 11.04mm; Radiation Hardening: No; Flammability Rating: UL94 V-0; ELV: Compliant; Lead Free: Lead Free; REACH SVHC: Unknown; ComponentLink1URL: https://datasheet.ciiva.com/709/eng-cd-640457-s2-709682.pdf; ComponentLink1Description: https://datasheet.ciiva.com/709/eng-cd-640457-s2-709682.pdf; ComponentLink2URL: https://datasheet.ciiva.com/14640/70083657-14640359.pdf; ComponentLink2Description: https://datasheet.ciiva.com/14640/70083657-14640359.pdf; ComponentLink3URL: https://datasheet.ciiva.com/3118/eng-ds-82056-mta-0608-3118505.pdf; ComponentLink3Description: https://datasheet.ciiva.com/3118/eng-ds-82056-mta-0608-3118505.pdf; ComponentLink4URL: https://datasheet.ciiva.com/11750/0900766b806a960f-11750281.pdf; ComponentLink4Description: https://datasheet.ciiva.com/11750/0900766b806a960f-11750281.pdf; ComponentLink5URL: https://datasheet.ciiva.com/30192/8852eng-ds-82056-mta-0608-30192537.pdf; ComponentLink5Description: https://datasheet.ciiva.com/30192/8852eng-ds-82056-mta-0608-30192537.pdf; ComponentLink6URL: https://datasheet.ciiva.com/16395/eng-ds-82056-mta-0608-16395963.pdf; ComponentLink6Description: https://datasheet.ciiva.com/16395/eng-ds-82056-mta-0608-16395963.pdf; ComponentLink7URL: https://datasheet.ciiva.com/25618/0900766b80e9e25b-25618125.pdf; ComponentLink7Description: https://datasheet.ciiva.com/25618/0900766b80e9e25b-25618125.pdf; ComponentLink8URL: https://datasheet.ciiva.com/16505/eng-ds-82056-mta-0608-16505423.pdf; ComponentLink8Description: https://datasheet.ciiva.com/16505/eng-ds-82056-mta-0608-16505423.pdf; ComponentLink9URL: https://datasheet.ciiva.com/16656/eng-ds-82056-mta-0608-16656527.pdf; ComponentLink9Description: https://datasheet.ciiva.com/16656/eng-ds-82056-mta-0608-16656527.pdf; RoHS: Yes; Category: Connectors; Stock 2: 28315; Pricing 2: 1=0.10000, 10=0.09400, 100=0.05800, 500=0.04802, 1000=0.04202, 5000=0.03601, 10000=0.03501 (USD); Contact Material: Copper Alloy; Color: Natural,White,Beige; Housing Color: Natural; Housing Material: Polyester; Contact Shape: Square; Number of Rows: 1; Package Quantity: 1; Number of Positions: 2; Backwall/Post Interruptions: No (Without); Contact Retention: No (Without); Mating Alignment: No (Without); Mating Retention: No (Without); PCB Mount Alignment: No (Without); Sealable: No (Without); Strain Relief: No (Without); Contact Style: Straight; Series: MTA-100; Contact Type: Male Pin; Length: 5.08mm; Height: 7.75mm; Pitch: 2.54mm; Tail Length: 3.56mm; RoHS Compliant: Yes; ComponentLink10URL: https://datasheet.ciiva.com/15175/getdatasheetpartid-46749-15175703.pdf?src-supplier=Verical; ComponentLink10Description: https://datasheet.ciiva.com/15175/getdatasheetpartid-46749-15175703.pdf?src-supplier=Verical; ComponentLink11URL: https://datasheet.ciiva.com/16394/eng-ds-82056-mta-0608-16394202.pdf?src-supplier=Future+Electronics; ComponentLink11Description: https://datasheet.ciiva.com/16394/eng-ds-82056-mta-0608-16394202.pdf?src-supplier=Future+Electronics; ComponentLink12URL: https://datasheet.ciiva.com/6045/1650873-6045536.pdf?src-supplier=Farnell; ComponentLink12Description: https://datasheet.ciiva.com/6045/1650873-6045536.pdf?src-supplier=Farnell; ComponentLink13URL: https://datasheet.ciiva.com/11746/0900766b806b3bd3-11746906.pdf?src-supplier=RSComponents; ComponentLink13Description: https://datasheet.ciiva.com/11746/0900766b806b3bd3-11746906.pdf?src-supplier=RSComponents; ComponentLink14URL: https://datasheet.ciiva.com/7703/eng-ds-82056-mta-0608-7703518.pdf?src-supplier=Element14; ComponentLink14Description: https://datasheet.ciiva.com/7703/eng-ds-82056-mta-0608-7703518.pdf?src-supplier=Element14; ComponentLink15URL: https://datasheet.ciiva.com/3118/eng-ds-82056-mta-0608-3118490.pdf?src-supplier=Avnet; ComponentLink15Description: https://datasheet.ciiva.com/3118/eng-ds-82056-mta-0608-3118490.pdf?src-supplier=Avnet; ComponentLink16URL: https://datasheet.ciiva.com/709/eng-cd-640454-y2-709679.pdf?src-supplier=Digi-Key; ComponentLink16Description: https://datasheet.ciiva.com/709/eng-cd-640454-y2-709679.pdf?src-supplier=Digi-Key; ComponentLink17URL: https://datasheet.ciiva.com/16684/eng-ds-82056-mta-0608-16684984.pdf?src-supplier=Avnet+Europe; ComponentLink17Description: https://datasheet.ciiva.com/16684/eng-ds-82056-mta-0608-16684984.pdf?src-supplier=Avnet+Europe; Supplier 1: Digi-Key
L9 = INDUCTOR
R24-R29 = Res_0402: Resistor
TP1-TP6 = TP_GND
TP7-TP10 = 5016: Test Point, Compact, SMT; Manufacturer: Keystone; CompType: Test Point Loop; SymbolVersion: 2008-04-04; PartNumber: 5016; PackageReference: Testpoint_Keystone_Compact; RoHS: Y; MountType: SMT; ComponentLink1Description: Datasheet URL; ComponentLink1URL: http://www.keyelco.com/userAssets/store/files/5016.PDF; Publisher: Texas Instruments; LatestRevisionDate: 2016-09-14; Supplier 1: Digi-Key; Supplier Part Number 1: 36-5016TR-ND; Supplier 2: Mouser; Supplier Part Number 2: 534-5016
U11 = LP5907MFX-3.3/NOPB: Ultra Low Noise, 250mA Linear Regulator; Manufacturer: Texas Instruments; SymbolCreator: a0799628; SizeArea_mm2: 8.12; SizeAreaWB_mm2: 14.82; SizeX_mm: 2.8; SizeY_mm: 2.9; SizeZ_mm: 1.45; CompType: IC; U/M: EA; Min Input Voltage: 2.2V; Number of Outputs: 1; Output Voltage: 1.8V; Dropout Voltage: 250mV; Max Input Voltage: 5.5V; Polarity: Positive; Quiescent Current: 25uA; Output Voltage Accuracy: 2%; Power Supply Rejection Ratio (PSRR): 82dB; Output Type: Fixed; SymbolVersion: 2014-03-21; PartNumber: LP5907MFX-1.8/NOPB; PackageReference: DBV0005A; PackageDescription: SOT-5; MountType: SMT; ComponentLink1Description: Datasheet Link; ComponentLink1URL: http://www.ti.com/lit/ds/symlink/lp5907.pdf; RoHS: Y; Publisher: Texas Instruments; LatestRevisionDate: 2016-09-20; Alternate Manufacturer: Texas Instruments; Supplier 1: Digi-Key; Manufacturer Part Number: LP5907MFX-1.8/NOPB; Category: Voltage Regulators - Linear; Stock 1: 17882; Pricing 1: 1=0.57000, 10=0.48900, 25=0.45640, 100=0.33900, 250=0.28684, 500=0.27380, 1000=0.20209 (USD); Mount: Surface Mount; Case/Package: SOT-23; Number of Pins: 5; Contact Plating: Tin; Min Operating Temperature: -40°C; Max Operating Temperature: 125°C; Packaging: Tape and Reel; Package Quantity: 3000; Output Current: 250mA; Number of Regulators: 1; Nominal Output Voltage: 1.8V; Accuracy: 2%; Max Output Current: 250mA; REACH SVHC: No SVHC; Lead Free: Lead Free; RoHS Compliant: Yes; ComponentLink2URL: https://datasheet.ciiva.com/15083/lp5907-15083594.pdf?src-supplier=Digi-Key; ComponentLink2Description: https://datasheet.ciiva.com/15083/lp5907-15083594.pdf?src-supplier=Digi-Key
U12 = CMP-09139-000005-1: DC DC CONVERTER 0.8-15V; Manufacturer: Analog Devices; Standoff Height: 0.3mm; Output Current: 2uA; Switching Frequency: 200-2200kHz; Max Supply Voltage: 40V; Min Supply Voltage: 3.2V; Output Type: AdjustableProgrammable; Max Junction Temp: +125°C; Number Of Outputs: 1; Nominal Supply Current: 3-8uA; Switching Topology: Buck; ComponentLink2URL: https://www.analog.com/media/en/technical-documentation/data-sheets/LTM8063.pdf; Height: 2.42mm; Temperature Range Low: -40°C; Mouser Description: Module DC-DC 1-OUT 0.8V to 15V 2A Automotive 28-Pin BGA Tray; Temperature Range High: +125°C; Octopart: https://octopart.com/ltm8063ey%23pbf-analog+devices-88947122; Category: IC; Device Class L3: Voltage Regulators - Switching; Output Voltage: 0.8-15V; Manufacturer Part Number: LTM8063EY#PBF; Package: BGA-28-05-08-1517; Automotive: No; RoHS: TRUE; Device Class L1: Integrated Circuits (ICs); Digikey Description: DC DC CONVERTER 0.8-15V; Ipc Land Pattern Name: BGA28C80P4X7_625X400X242; Lead Free: Yes; Temperature: -40°C to +125°C; Device Class L2: Power Management ICs; ComponentLink2Description: Datasheet
U13 = CMP-0784-00192-1: Ultralow Noise, High Accuracy Voltage Reference, 4.096 V Output, 3 to 15 V Supply, Industrial, 8-pin SOIC (R-8), Tube; Manufacturer: Analog Devices; Max V Supply (V): 15; Min V Supply (V): 3; Vout: 4.096V; Ref Out TC (ppm/C): 2; ComponentLink4URL: Product URL:http://www.analog.com/en/special-linear-functions/voltage-references/adr4540/products/product.html; Mounting Technology: Surface Mount; ComponentLink1Description: Manufacturer URL; PackageDescription: 8-Pin Standard Small Outline Package, Body 4.9 x 3.9 mm, Pitch 1.27 mm; ComponentLink2URL: http://www.analog.com/static/imported-files/data_sheets/ADR4520_4525_4530_4533_4540_4550.pdf; ComponentLink1URL: http://www.analog.com/en/index.html; DatasheetVersion: Rev. 0; ComponentLink4Description: URL Link1; Operating Temp Range: -40 to 125 degC; PartNumber: ADR4540BRZ; ComponentLink2Description: Datasheet; ComponentLink3URL: http://www.analog.com/static/imported-files/packages/PKG_PDF/SOIC_Narrow%20(R)/R_8.pdf; ComponentLink3Description: Package Specification; PackageVersion: 060506-A, 06/2006; Packing: Tube; PackageReference: R-8; Code_JEDEC: MS-012-AA; Supplier 1: Digi-Key; Supplier Part Number 1: ADR4540BRZ-ND
U14 = CMP-04918-000010-1: IC REG BUCK ADJ 2A TSOT23-6; Manufacturer: Texas Instruments; Min Supply Voltage: 4.5V; Nominal Supply Current: 380uA; Output Type: AdjustableProgrammable; Standoff Height: 0mm; Max Supply Voltage: 17V; Output Voltage: 0.76-7V; Max Duty Cycle: 80%; Switching Frequency: 580kHz; Number Of Outputs: 1; Max Junction Temp: +125°C; Temperature Range Low: -40°C; Device Class L2: Power Management ICs; Package: DDC0006A; Switching Topology: Buck; Manufacturer Part Number: TPS562201DDCT; Category: IC; RoHS: TRUE; Digikey Description: IC REG BUCK ADJ 2A TSOT23-6; Height: 1.1mm; Temperature: -40°C to +125°C; Temperature Range High: +125°C; Octopart: https://octopart.com/tps562201ddct-texas+instruments-68059584; Lead Free: Yes; ComponentLink2URL: http://www.ti.com/lit/ds/symlink/tps562201.pdf; Device Class L3: Voltage Regulators - Switching; Device Class L1: Integrated Circuits (ICs); Output Current: 2A; ComponentLink2Description: Datasheet; Mouser Description: Conv DC-DC 4.5V to 17V Synchronous Step Down Single-Out 0.76V to 7V 2A 6-Pin TSOT-23 T/R; Automotive: No

## Sheet lvds_transceiver.SchDoc
size Letter; DocumentNumber: 4; SheetNumber: 4; SheetTotal: 6
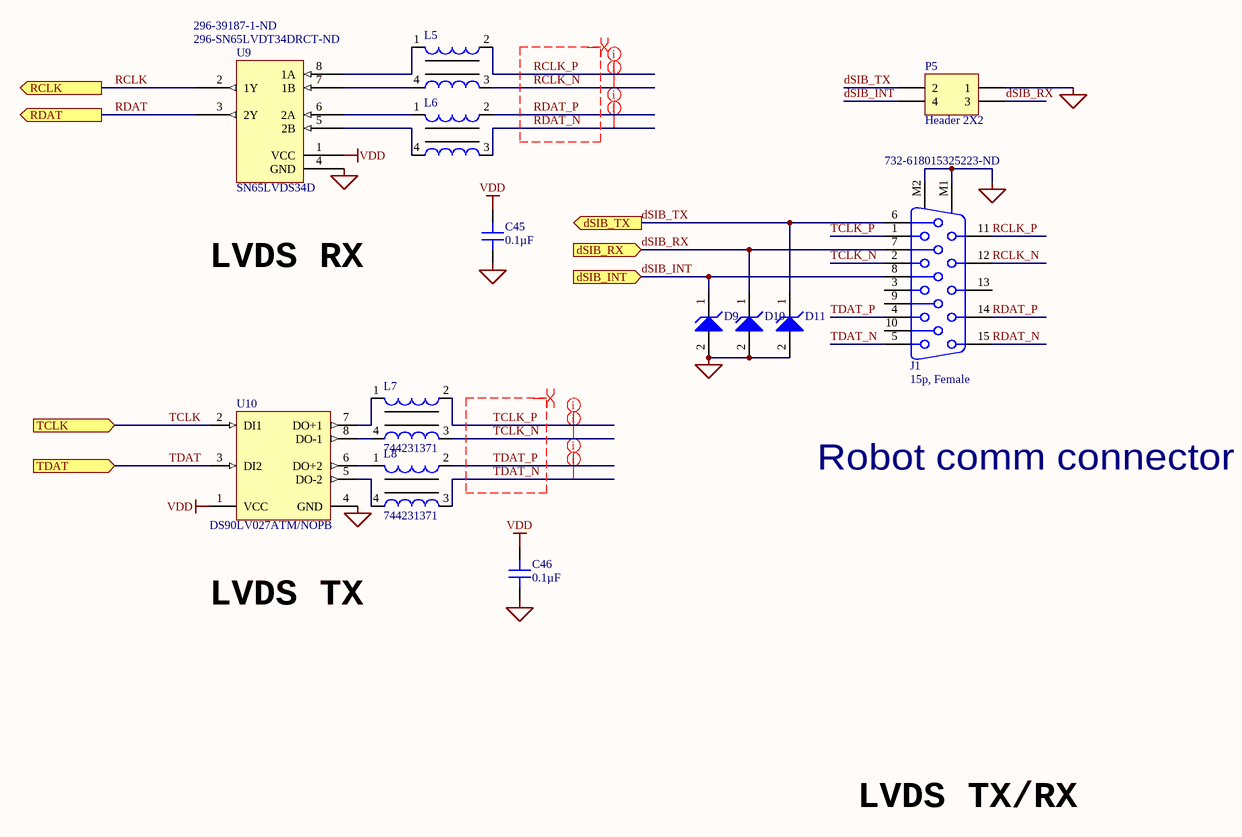
[diagram p3: lvds_transceiver.SchDoc]

### Parts
C45  0.1µF  [FP-GRM155-0_05-IPC_B]
C46  0.1µF  [FP-GRM155-0_05-IPC_B]
D9  ESD9L3.3ST5G  [ONSC-SOD-923-2-514AB-01_V]  (value not drawn)
D10  ESD9L3.3ST5G  [ONSC-SOD-923-2-514AB-01_V]  (value not drawn)
D11  ESD9L3.3ST5G  [ONSC-SOD-923-2-514AB-01_V]  (value not drawn)
J1  15p, Female  Supplier Part Number 1: 732-618015325223-ND  [618015325223]
L5  744231371  [WE-CNSW-0805]  (value not drawn)
L6  744231371  [WE-CNSW-0805]  (value not drawn)
L7  744231371  [WE-CNSW-0805]
L8  744231371  [WE-CNSW-0805]
P5  Header 2X2  [DF11-4DP-2DSA]
U9  SN65LVDS34D  Supplier Part Number 1: 296-SN65LVDT34DRCT-ND  Supplier Part Number 2: 296-39187-1-ND  [SOIC127P600X175-8N]
U10  DS90LV027ATM/NOPB  [D0008A_L]

### Ports
dSIB_INT (in), dSIB_RX (in), dSIB_TX (out), RCLK (out), RDAT (out), TCLK (in), TDAT (in)

### Nets
GND: C45.1 C46.1 D9.2(A) D10.2(A) D11.2(A) J1.M1 J1.M2 P5.1 U9.4(GND) U10.4(GND)
VDD: C45.2 C46.2 U9.1(VCC) U10.1(VCC)
dSIB_INT: D9.1(K) J1.8 P5.4 ; port dSIB_INT
dSIB_RX: D10.1(K) J1.7 P5.3 ; port dSIB_RX
dSIB_TX: D11.1(K) J1.6 P5.2 ; port dSIB_TX
RCLK: U9.2(1Y) ; port RCLK  [project net LVDS_RCLK]
RCLK_N: J1.12 L5.3
RCLK_P: J1.11 L5.2
RDAT: U9.3(2Y) ; port RDAT  [project net LVDS_RDAT]
RDAT_N: J1.15 L6.3
RDAT_P: J1.14 L6.2
TCLK: U10.2(DI1) ; port TCLK  [project net LVDS_TCLK]
TCLK_N: J1.2 L7.3
TCLK_P: J1.1 L7.2
TDAT: U10.3(DI2) ; port TDAT  [project net LVDS_TDAT]
TDAT_N: J1.5 L8.3
TDAT_P: J1.4 L8.2
NetL5_1: L5.1 U9.8(1A)
NetL5_4: L5.4 U9.7(1B)
NetL6_1: L6.1 U9.6(2A)
NetL6_4: L6.4 U9.5(2B)
NetL7_1: L7.1 U10.7(DO+1)
NetL7_4: L7.4 U10.8(DO-1)
NetL8_1: L8.1 U10.6(DO+2)
NetL8_4: L8.4 U10.5(DO-2)

Not connected (* = marked no-connect by the designer): J1 3 9 10 13

### Layout directives
net class 100ohm: RCLK_N, RCLK_P, RDAT_N, RDAT_P, TCLK_N, TCLK_P, TDAT_N, TDAT_P
differential pair: RCLK_N, RCLK_P, RDAT_N, RDAT_P, TCLK_N, TCLK_P, TDAT_N, TDAT_P

### Notes on the sheet
- LVDS RX
- Robot comm connector
- LVDS TX
- LVDS TX/RX

### Library data of the parts
C45 C46 = 04023C104KAT2A: as C80 on sheet top; Value: 0.1µF; Part Number: 04023C104KAT2A; Applications: General Purpose; Capacitance: 0.1µF; ComponentLink1Description: Datasheet; ComponentLink1URL: http://datasheets.avx.com/X7RDielectric.pdf; ComponentLink2Description: DigiKey Link; ComponentLink2URL: http://digikey.com/product-detail/en/avx-corporation/04023C104KAT2A/478-7868-1-ND/3881491; Device Package: 0402 (1005 Metric); LastUpdated: 9/2/2020 1:02:21 AM; Lifecycle Status: Active; Minimum Order: 1; Mounting Type: Surface Mount, MLCC; Operating Temperature: -55°C ~ 125°C; Package / Case: 0402 (1005 Metric); Packaging: CutTape; PartId: 3190; Part Status: Active; Price: 0.13; Series: -; Size / Dimension: 0.039" L x 0.020" W (1.00mm x 0.50mm); Supplier 1: DigiKey; Supplier Part Number 1: 478-7868-1-ND; Temperature Coefficient: X7R; Thickness (Max): 0.022" (0.55mm); Voltage - Rated: 25V
D9-D11 = CMP-1063-00113-1: Transient Voltage Suppressor, ESD Protection Diode with Ultra-Low Capacitance, 2-Pin SOD-923, Pb-Free, Tape and Reel; Manufacturer: On Semiconductor; VRWM Max (V): 3.3; V(BR) Min (V): 4.8; Number of Lines: 1; Direction: Unidirectional; C Max (pF): 0.9; ComponentLink1URL: http://www.onsemi.com/; ComponentLink3Description: Package Specification; ComponentLink1Description: Manufacturer URL; DatasheetVersion: Rev. 5; ComponentLink2URL: http://www.onsemi.cn/pub_link/Collateral/ESD9L-D.PDF; RoHS: Pb-Free; ComponentLink3URL: http://www.onsemi.com/pub_link/Collateral/514AB.PDF; ComponentLink2Description: Datasheet; Mounting Technology: Surface Mount; PackageReference: SOD-923-2-514AB-01; Packing: Tape and Reel; PartNumber: ESD9L3.3ST5G; PackageDescription: 2-Pin SOD, Body 0.8 x 0.6 mm; IR Max (uA): 1; PackageVersion: Rev. C, 03/2011
J1 = 618015325223: WR-DSUB Female High Density Angled PCB Connector without Hex Screw, 15p; Manufacturer: Wurth Electronics; PinNumber: 15; Published: June 2016; Publisher: Wurth Elektronik; ComponentLink1Description: Manufacturer; ComponentLink1URL: http://www.we-online.de; ComponentLink2Description: Datasheet; ComponentLink2URL: http://katalog.we-online.de/em/datasheet/6180xx325223.pdf; PartNumber: 618015325223; Supplier 1: Digi-Key; Manufacturer Part Number: 618015325223; RoHS: Yes; Category: D-Sub Connectors; Stock 1: 157; Pricing 1: 1=4.02000, 10=3.81000, 50=3.38400, 100=2.95200, 250=2.53200, 500=2.25600 (USD); RoHS Compliant: Yes
L5-L8 = CMP-0222-00042-1: SMD Common Mode Noise Suppressor WE-CNSW, Z = 370 Ohm; Impedance: 370 Ohm; ComponentLink2URL: http://www.we-online.de/katalog/media/pdf/744231371.pdf; ComponentLink1Description: Manufacturer Link; PackageReference: WE-CNSW-0805; PackageDescription: SMD Inductor, 4-Leads, Body 1.4 x 2.2 mm; ComponentLink2Description: Datasheet; DatasheetVersion: ver 4, Nov-2010; ComponentLink1URL: http://www.we-online.com; PackageVersion: 2010
P5 = Header 2X2: Header, 2-Pin, Dual row; LatestRevisionDate: 17-Jul-2002; LatestRevisionNote: Re-released for DXP Platform.; Publisher: Altium Limited
U9 = SN65LVDS34D: LVDS Receiver 8-Pin SOIC T/R; Manufacturer: Texas Instruments; Manufacturer Part Number: SN65LVDS34DR; Number of Receivers: 4; Operating Supply Voltage: 3.3V; Propagation Delay: 9ns; Max Power Dissipation: 950mW; Nominal Supply Current: 12mA; Max Supply Voltage: 3.6V; Min Supply Voltage: 3V; Data Rate: 400Mbps; Receiver Hysteresis: 50mV; Max Input Current: 75uA; Stock 1: 3654; Pricing 1: 1=2.27, 10=2.042, 100=1.641, 500=1.34828, 1000=1.11714 (USD); Mount: Surface Mount; Case/Package: SOIC; Number of Pins: 8; Weight: 0.002561oz; Contact Plating: Gold; Min Operating Temperature: -40°C; Max Operating Temperature: 85°C; Packaging: Tape and Reel; Package Quantity: 2500; Number of Elements: 4; Number of Drivers: 4; Turn-On Delay Time: 9ns; Power Dissipation: 950mW; Logic Function: Receiver; Lead Free: Lead Free; ComponentLink1URL: https://datasheet.ciiva.com/1770/sn65lvdt33-1770664.pdf; ComponentLink1Description: https://datasheet.ciiva.com/1770/sn65lvdt33-1770664.pdf; ComponentLink2URL: https://datasheet.ciiva.com/3152/sn65lvds33-3152872.pdf; ComponentLink2Description: https://datasheet.ciiva.com/3152/sn65lvds33-3152872.pdf; RoHS: Yes; Category: Interface ICs; Stock 2: 2291; Pricing 2: 1=2.75000, 10=2.47200, 25=2.33200, 100=1.86560, 250=1.63240, 500=1.58576, 1000=1.25928 (USD); Series: 65LVDT; Supply Current: 12mA; Radiation Hardening: No; RoHS Compliant: Yes; ComponentLink3URL: https://datasheet.ciiva.com/15133/getdatasheetpartid-524946-15133570.pdf?src-supplier=Verical; ComponentLink3Description: https://datasheet.ciiva.com/15133/getdatasheetpartid-524946-15133570.pdf?src-supplier=Verical; ComponentLink4URL: https://datasheet.ciiva.com/26828/sn65lvdt34dr-26828764.pdf?src-supplier=IIIC; ComponentLink4Description: https://datasheet.ciiva.com/26828/sn65lvdt34dr-26828764.pdf?src-supplier=IIIC; ComponentLink5URL: https://datasheet.ciiva.com/1770/sn65lvdt33-1770866.pdf?src-supplier=Digi-Key; ComponentLink5Description: https://datasheet.ciiva.com/1770/sn65lvdt33-1770866.pdf?src-supplier=Digi-Key; ComponentLink6URL: https://datasheet.ciiva.com/3153/sn65lvds33-3153018.pdf?src-supplier=Avnet; ComponentLink6Description: https://datasheet.ciiva.com/3153/sn65lvds33-3153018.pdf?src-supplier=Avnet; ComponentLink7URL: https://datasheet.ciiva.com/26002/slls490b-26002508.pdf?src-supplier=Avnet+Europe; ComponentLink7Description: https://datasheet.ciiva.com/26002/slls490b-26002508.pdf?src-supplier=Avnet+Europe; Supplier 1: Digi-Key; Supplier 2: Digi-Key
U10 = CMP-0058-00996-3: LVDS Dual High Speed Differential Driver, 8-pin Narrow SOIC, Pb-Free; Manufacturer: Texas Instruments; PowerWise: N; CompType: Interface IC; PackageTopMarking: NSZXTT*LV27A*TM; ComponentLink1Description: Datasheet URL; Code_JEDEC: MS-012-AA; PinCount: 8; PackageDescription: SOIC Narrow, 4.9 x 3.9 x 1.45mm, 8 Lead, 1.27mm Pitch; RoHS: Y; ComponentLink1URL: http://www.ti.com/general/docs/lit/getliterature.tsp?genericPartNumber=DS90LV027A&fileType=pdf; PackageReference: D0008A; Code_IPC: SOIC127P600-8